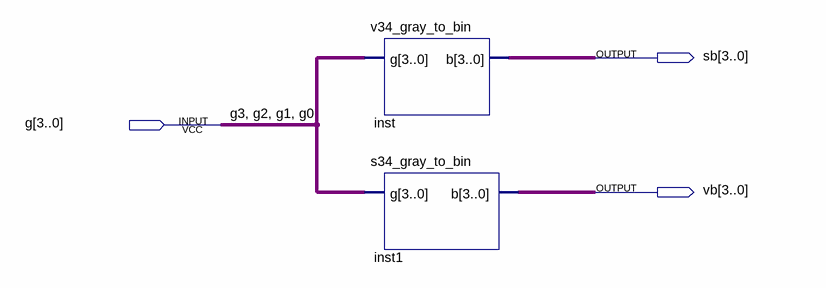
[diagram p0: schematic sheet]
// Quartus schematic sv34_gray_to_bin.bdf as structural Verilog: 2 symbols, 3 pins
module sv34_gray_to_bin (
  input  [3:0] g,
  output [3:0] sb,
  output [3:0] vb
);

  v34_gray_to_bin inst (.g(g), .b(sb));
  s34_gray_to_bin inst1 (.g(g), .b(vb));
endmodule
